# EAGLE design PiFlash (EAGLE 9.6.2)

## Sheet 1 of 4: PI Connection
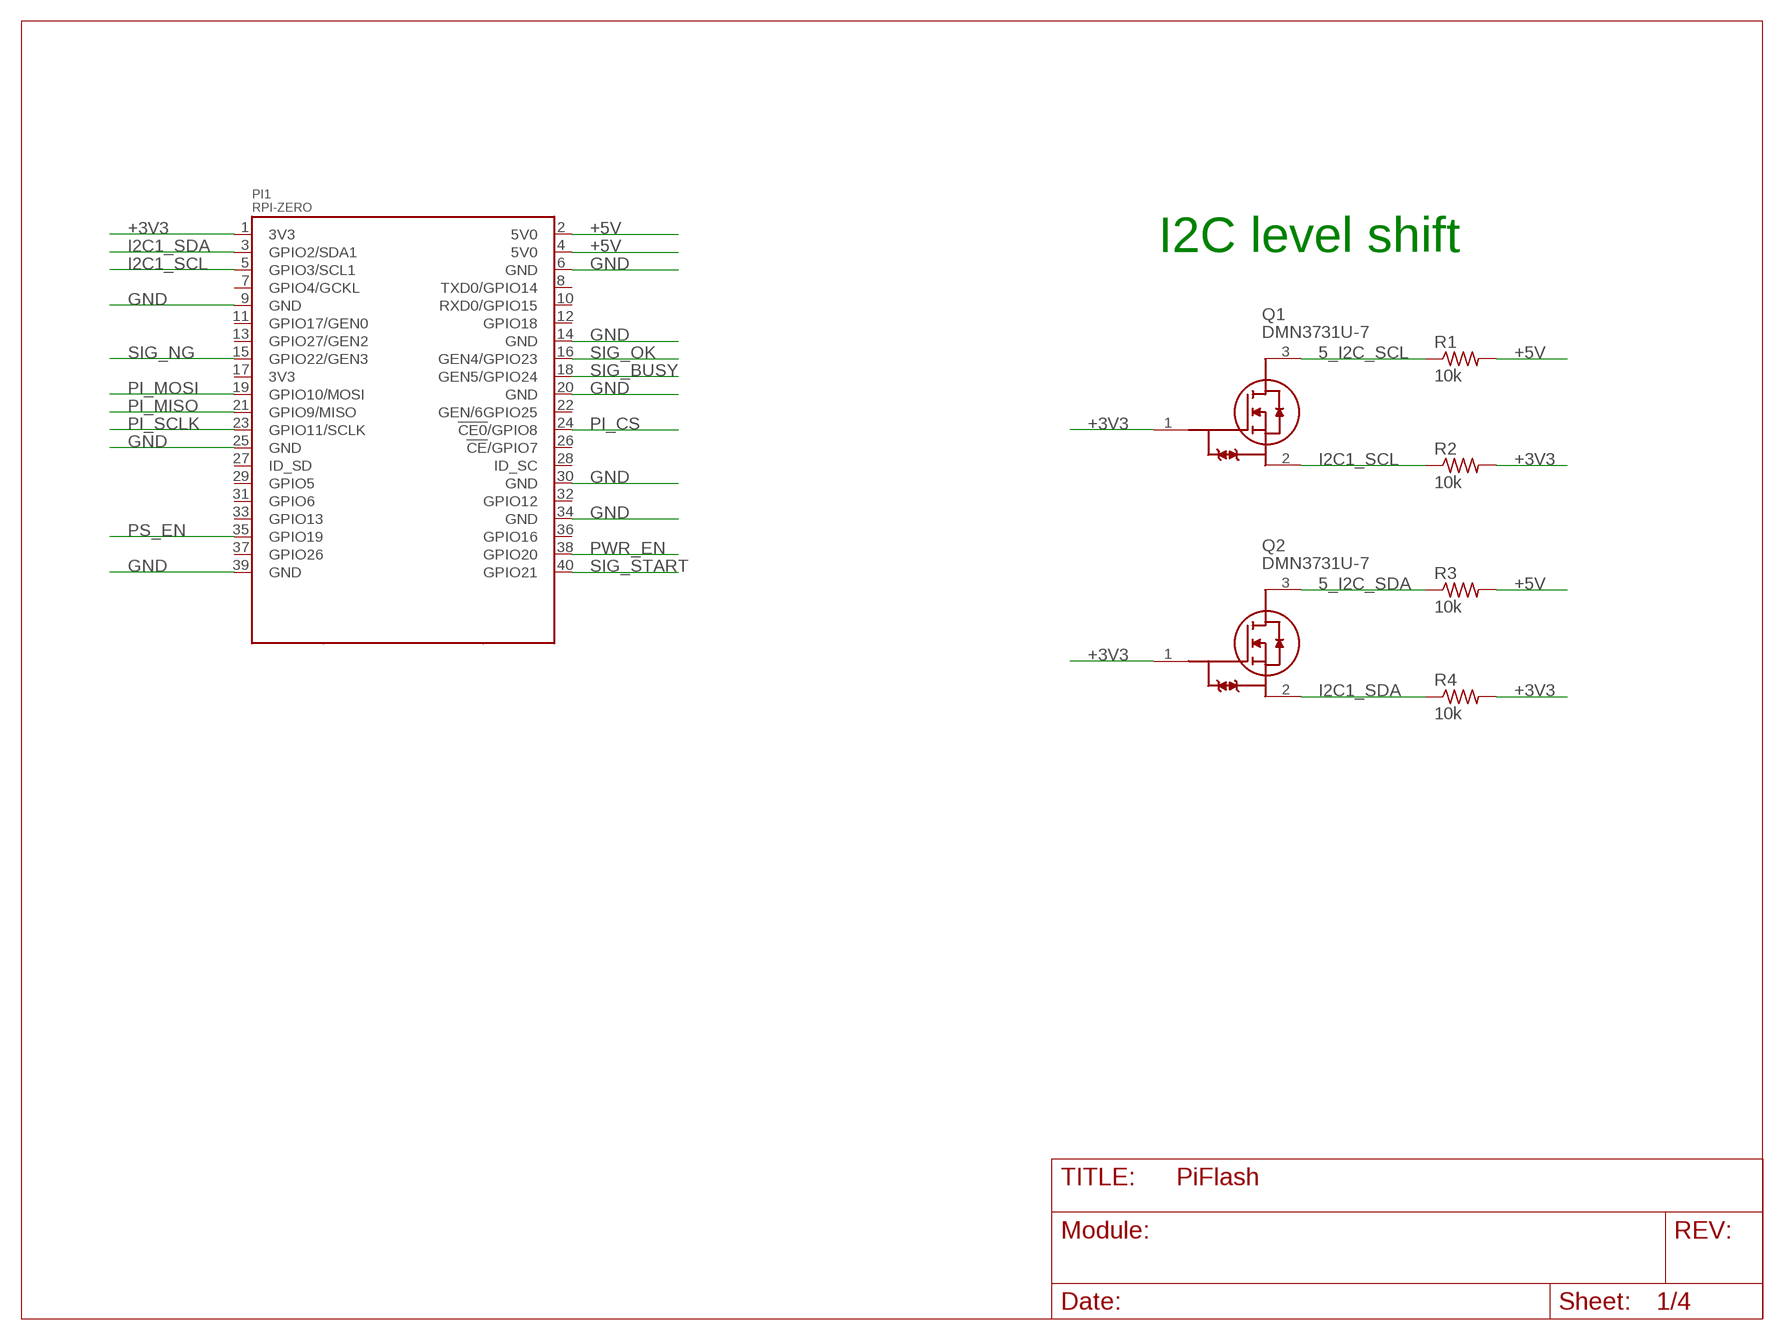
[diagram p0: schematic, sheet 1]

### Parts
PI1  RPI-ZERO  [RASPBERRYPI_BASTELSTUBE_V13_RASPI_BOARD_B+_FULL]
Q1  DMN3731U-7  [SOT96P240X110-3N]
Q2  DMN3731U-7  [SOT96P240X110-3N]
R1  10k  R-US_R0603  [R0603]
R2  10k  R-US_R0603  [R0603]
R3  10k  R-US_R0603  [R0603]
R4  10k  R-US_R0603  [R0603]

### Nets
5_I2C_SCL: Q1.3(D) R1.1 ; also sheet 2,3
5_I2C_SDA: Q2.3(D) R3.1 ; also sheet 2,3
+3V3: PI1.1(3V3) Q1.1(G) Q2.1(G) R2.2 R4.2 ; also sheet 2,3,4
+5V: PI1.2(5V0) PI1.4(5V0) R1.2 R3.2 ; also sheet 2,3
GND: PI1.6(GND) PI1.9(GND) PI1.14(GND) PI1.20(GND) PI1.25(GND) PI1.30(GND) PI1.34(GND) PI1.39(GND) ; also sheet 2,3,4
I2C1_SCL: PI1.5(GPIO3/SCL1) Q1.2(S) R2.1 ; also sheet 3
I2C1_SDA: PI1.3(GPIO2/SDA1) Q2.2(S) R4.1 ; also sheet 3
PI_CS: PI1.24(!CE0!/GPIO8) ; also sheet 4
PI_MISO: PI1.21(GPIO9/MISO) ; also sheet 4
PI_MOSI: PI1.19(GPIO10/MOSI) ; also sheet 4
PI_SCLK: PI1.23(GPIO11/SCLK) ; also sheet 4
PS_EN: PI1.35(GPIO19) ; also sheet 2
PWR_EN: PI1.38(GPIO20) ; also sheet 2
SIG_BUSY: PI1.18(GEN5/GPIO24) ; also sheet 4
SIG_NG: PI1.15(GPIO22/GEN3) ; also sheet 4
SIG_OK: PI1.16(GEN4/GPIO23) ; also sheet 4
SIG_START: PI1.40(GPIO21) ; also sheet 4
Unconnected: PI1.7(GPIO4/GCKL) PI1.8(TXD0/GPIO14) PI1.10(RXD0/GPIO15) PI1.11(GPIO17/GEN0) PI1.12(GPIO18) PI1.13(GPIO27/GEN2) PI1.17(3V3) PI1.22(GEN/6GPIO25) PI1.26(!CE!/GPIO7) PI1.27(ID_SD) PI1.28(ID_SC) PI1.29(GPIO5) PI1.31(GPIO6) PI1.32(GPIO12) PI1.33(GPIO13) PI1.36(GPIO16) PI1.37(GPIO26)

### Notes on the sheet
- I2C level shift

## Sheet 2 of 4: Power supply
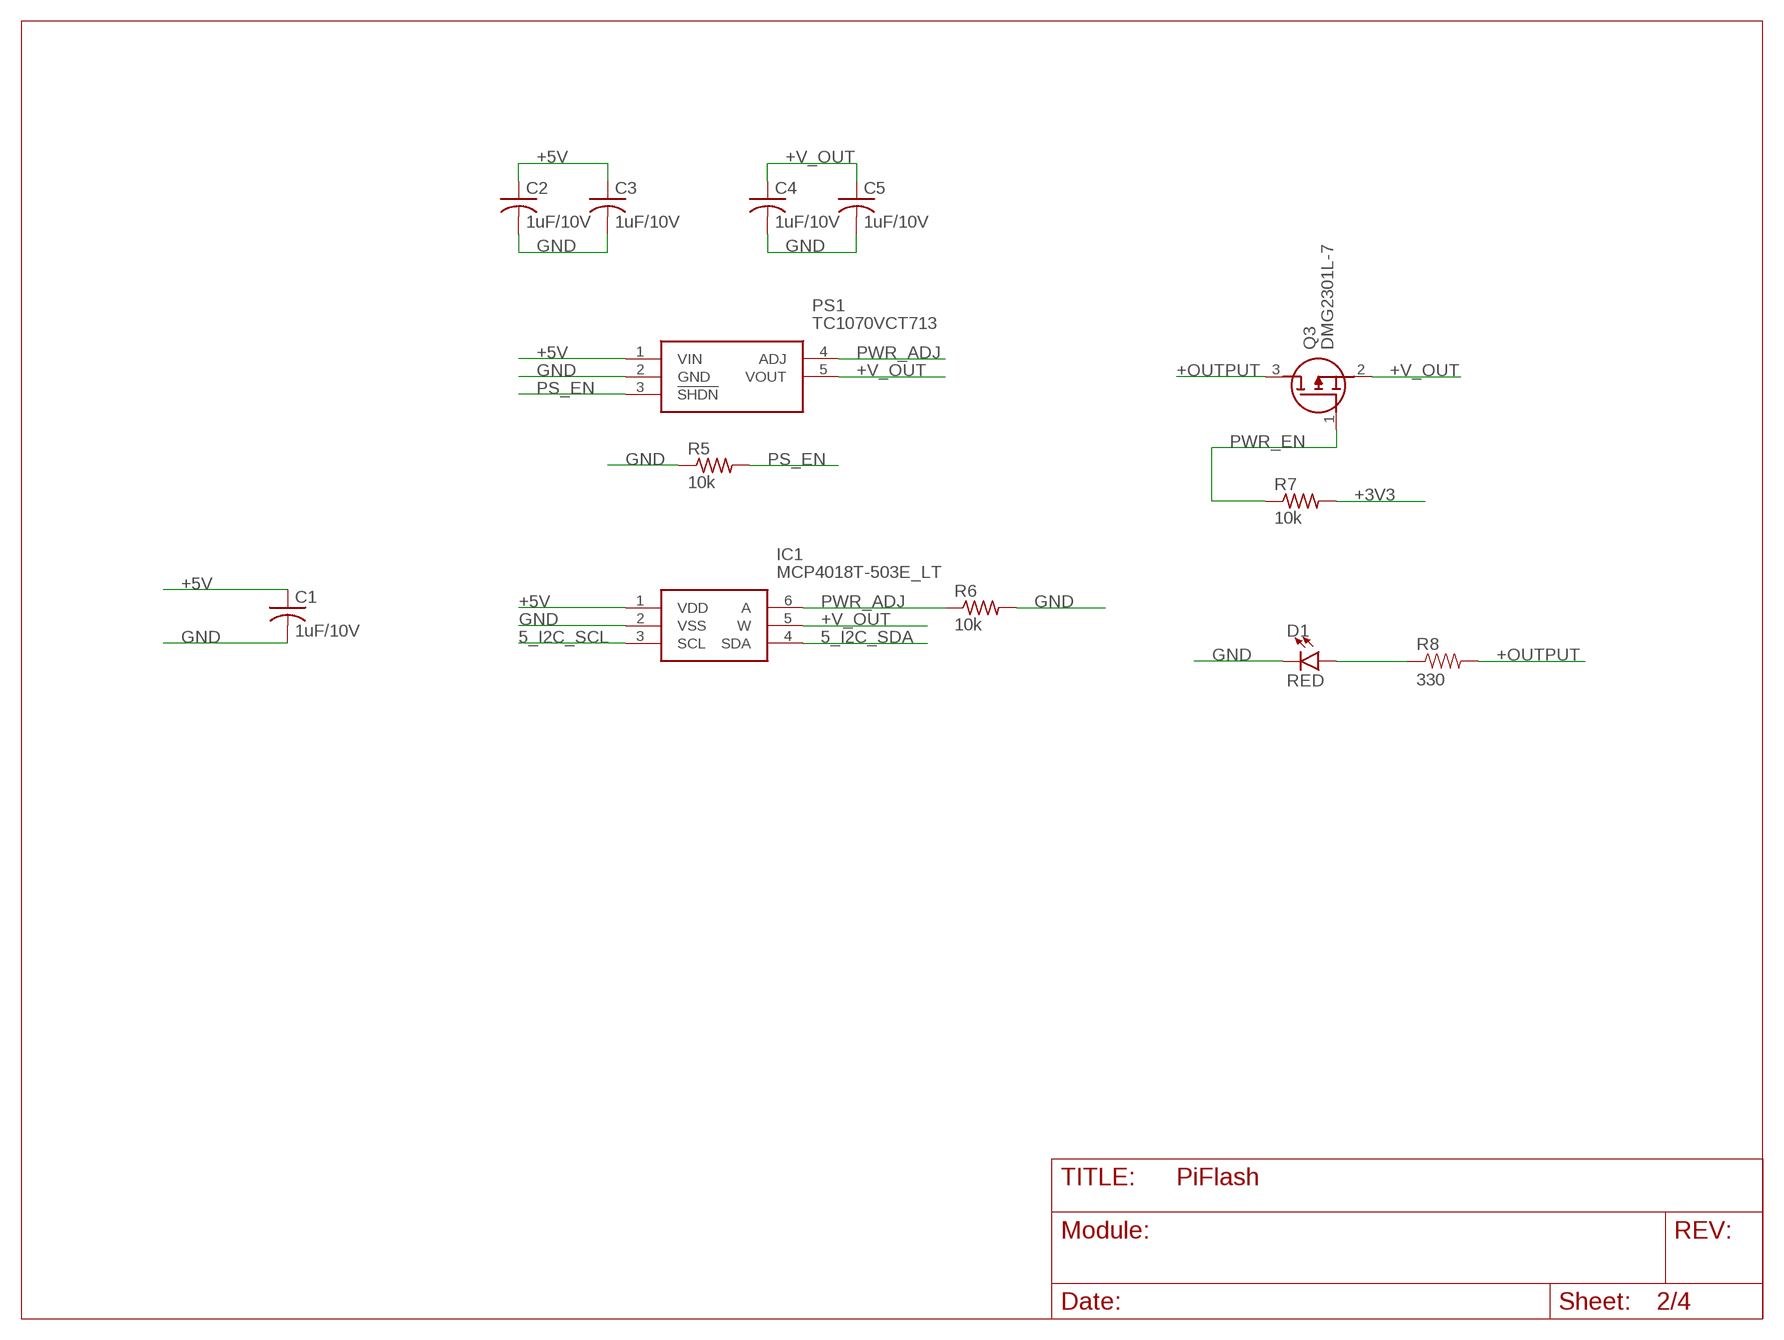
[diagram p1: schematic, sheet 2]

### Parts
C1  1uF/10V  C-USC0603  [C0603]
C2  1uF/10V  C-USC0603  [C0603]
C3  1uF/10V  C-USC0603  [C0603]
C4  1uF/10V  C-USC0603  [C0603]
C5  1uF/10V  C-USC0603  [C0603]
D1  RED  LED-RED_0402  [LED-0402]
IC1  MCP4018T-503E_LT  [SOT65P210X110-6N]
PS1  TC1070VCT713  [SOT95P280X145-5N]
Q3  DMG2301L-7  [SOT96P240X110-3N]
R5  10k  R-US_R0603  [R0603]
R6  10k  R-US_R0603  [R0603]
R7  10k  R-US_R0603  [R0603]
R8  330  RES_0402R0402  [0402]

### Nets
5_I2C_SCL: IC1.3(SCL) ; also sheet 1,3
5_I2C_SDA: IC1.4(SDA) ; also sheet 1,3
+3V3: R7.2 ; also sheet 1,3,4
+5V: C1.1 C2.1 C3.1 IC1.1(VDD) PS1.1(VIN) ; also sheet 1,3
+OUTPUT: Q3.3(D) R8.2 ; also sheet 3,4
+V_OUT: C4.1 C5.1 IC1.5(W) PS1.5(VOUT) Q3.2(S) ; also sheet 3,4
GND: C1.2 C2.2 C3.2 C4.2 C5.2 D1.C IC1.2(VSS) PS1.2(GND) R5.1 R6.2 ; also sheet 1,3,4
N$1: D1.A R8.1
PS_EN: PS1.3(!SHDN) R5.2 ; also sheet 1
PWR_ADJ: IC1.6(A) PS1.4(ADJ) R6.1
PWR_EN: Q3.1(G) R7.1 ; also sheet 1

## Sheet 3 of 4: Voltage monitor
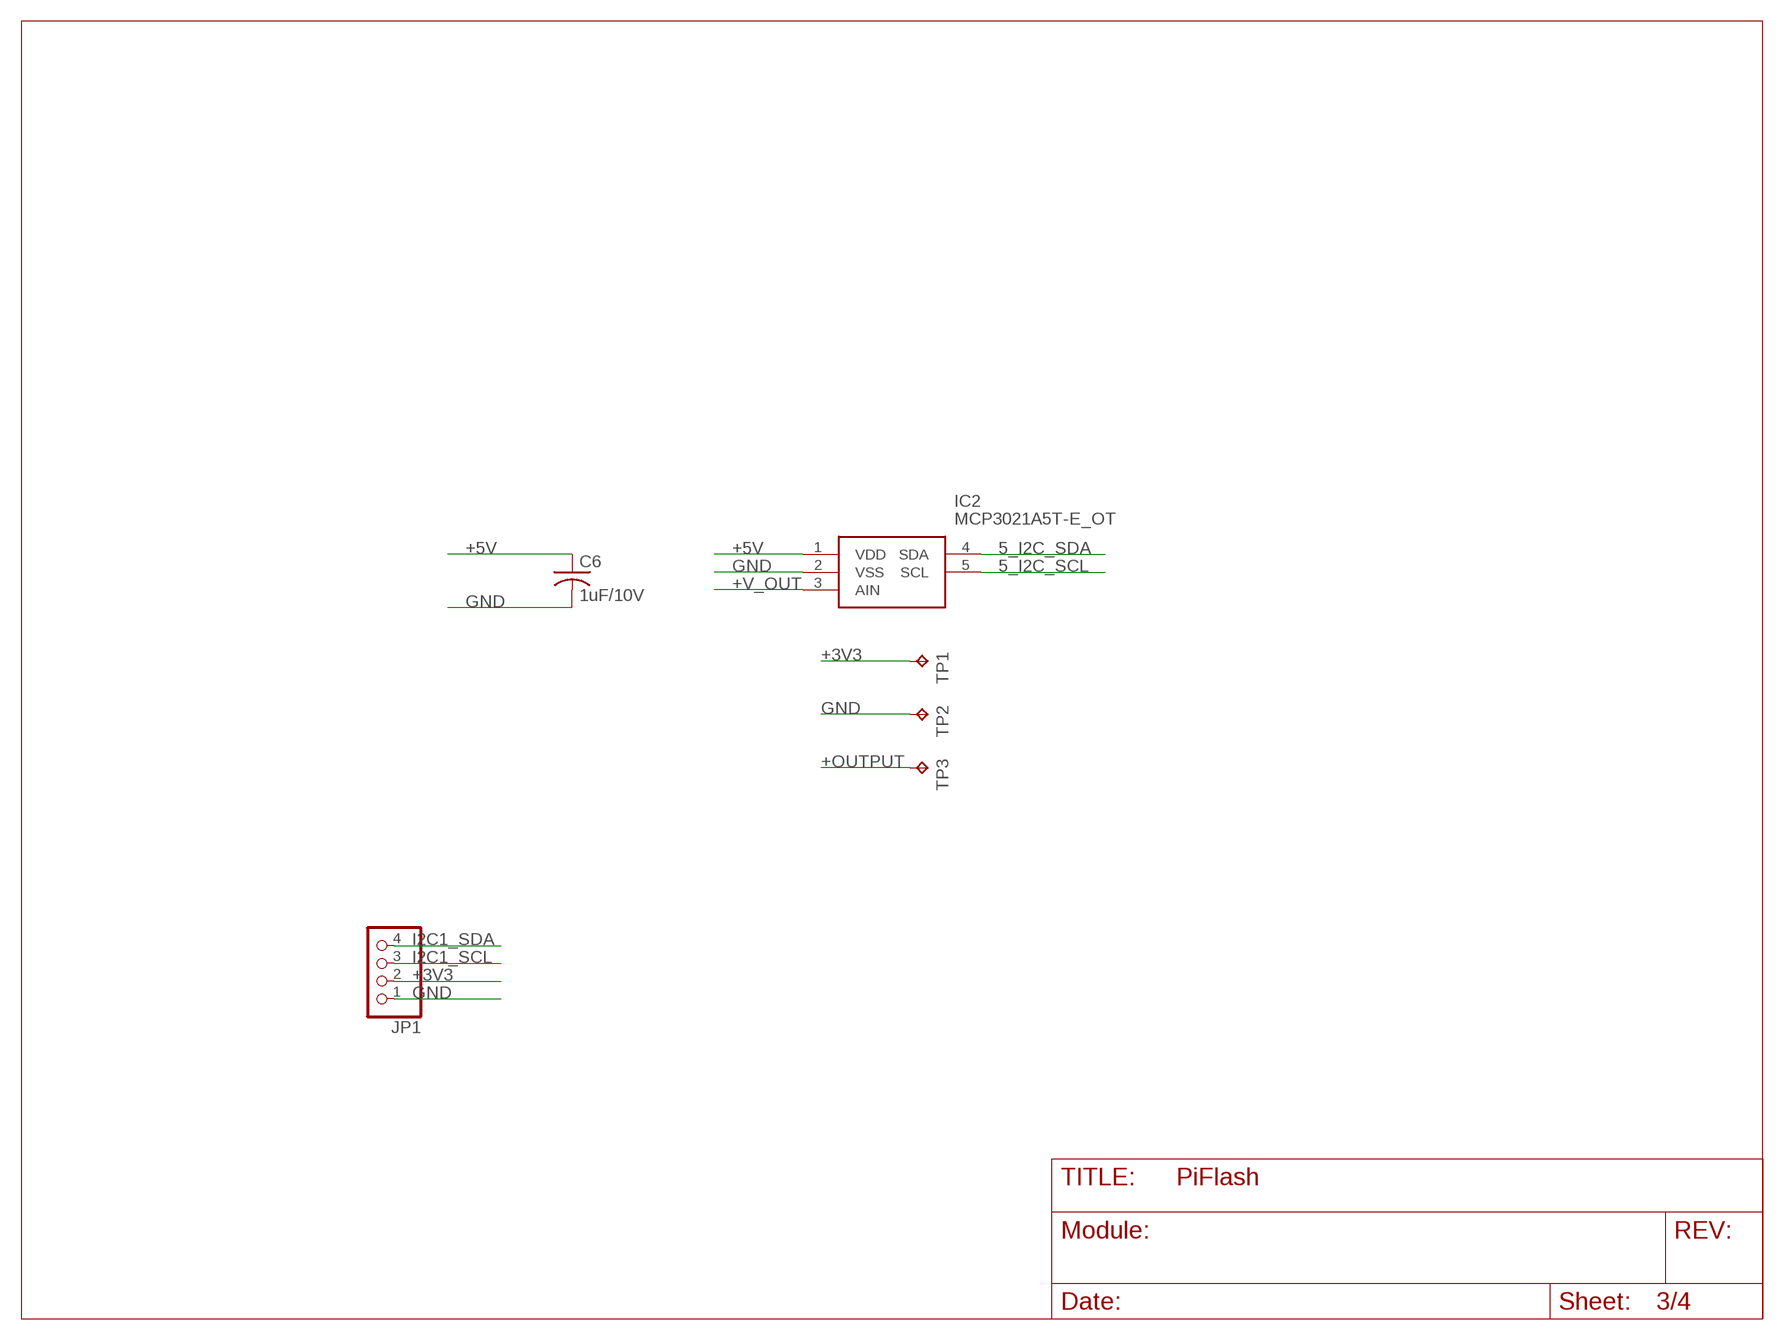
[diagram p2: schematic, sheet 3]

### Parts
C6  1uF/10V  C-USC0603  [C0603]
IC2  MCP3021A5T-E_OT  [SOT95P280X145-5N]
JP1  PINHD-1X41X04_RND  [1X04_SMALL]
TP1  +3v3  TPTP16R  [TP16R]
TP2  TPTP16R  [TP16R]
TP3  TPTP16R  [TP16R]

### Nets
5_I2C_SCL: IC2.5(SCL) ; also sheet 1,2
5_I2C_SDA: IC2.4(SDA) ; also sheet 1,2
+3V3: JP1.2 TP1.TP ; also sheet 1,2,4
+5V: C6.1 IC2.1(VDD) ; also sheet 1,2
+OUTPUT: TP3.TP ; also sheet 2,4
+V_OUT: IC2.3(AIN) ; also sheet 2,4
GND: C6.2 IC2.2(VSS) JP1.1 TP2.TP ; also sheet 1,2,4
I2C1_SCL: JP1.3 ; also sheet 1
I2C1_SDA: JP1.4 ; also sheet 1

## Sheet 4 of 4: Output
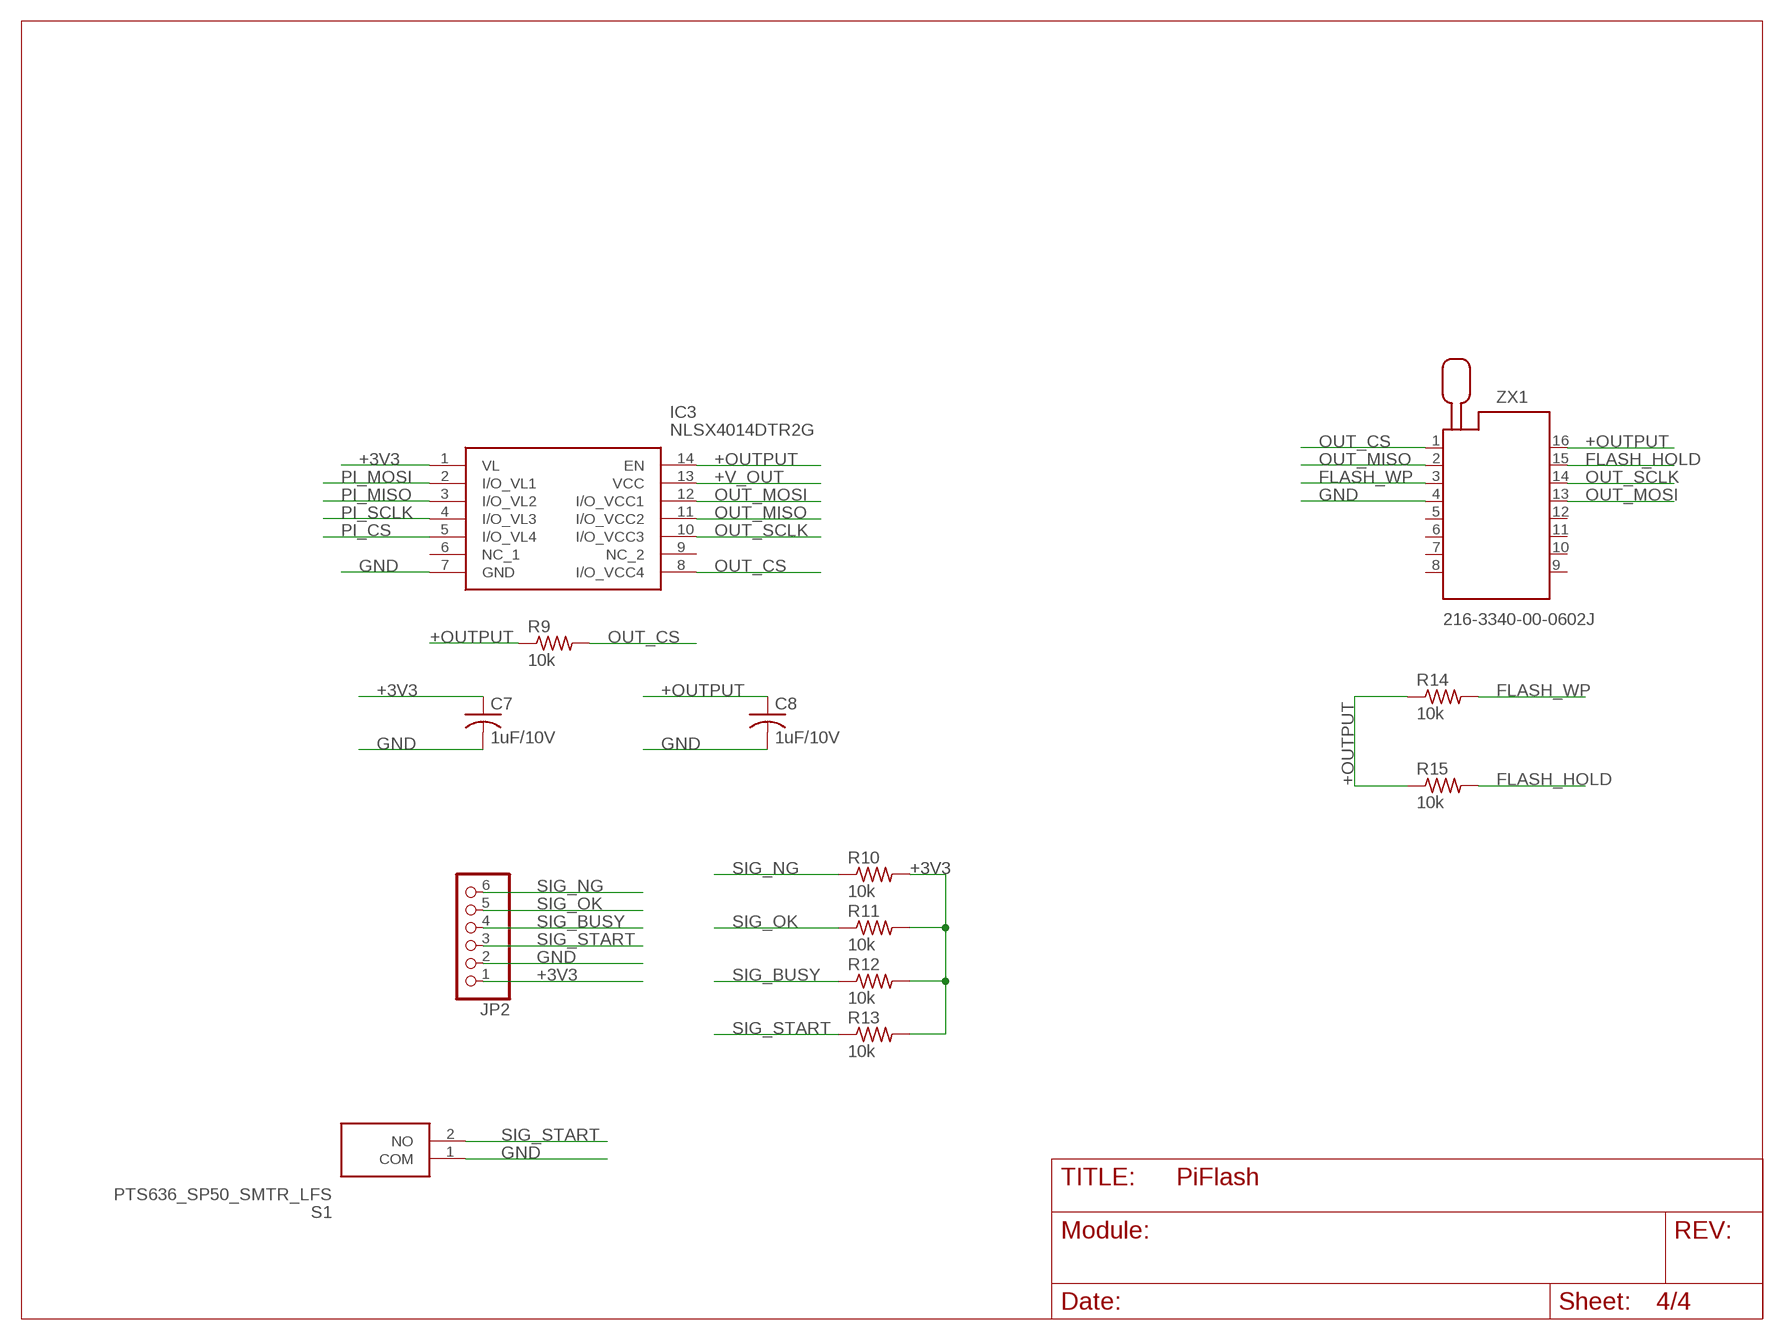
[diagram p3: schematic, sheet 4]

### Parts
C7  1uF/10V  C-USC0603  [C0603]
C8  1uF/10V  C-USC0603  [C0603]
IC3  NLSX4014DTR2G  [SOP65P640X120-14N]
JP2  PINHD-1X6  [1X06]
R9  10k  R-US_R0603  [R0603]
R10  10k  R-US_R0603  [R0603]
R11  10k  R-US_R0603  [R0603]
R12  10k  R-US_R0603  [R0603]
R13  10k  R-US_R0603  [R0603]
R14  10k  R-US_R0603  [R0603]
R15  10k  R-US_R0603  [R0603]
S1  PTS636_SP50_SMTR_LFS  [PTS636SP50SMTRLFS]
ZX1  216-3340-00-0602J  [216-3340-00-0602J]

### Nets
+3V3: C7.1 IC3.1(VL) JP2.1 R10.2 R11.2 R12.2 R13.2 ; also sheet 1,2,3
+OUTPUT: C8.1 IC3.14(EN) R9.1 R14.1 R15.1 ZX1.16 ; also sheet 2,3
+V_OUT: IC3.13(VCC) ; also sheet 2,3
FLASH_HOLD: R15.2 ZX1.15
FLASH_WP: R14.2 ZX1.3
GND: C7.2 C8.2 IC3.7(GND) JP2.2 S1.1(COM) ZX1.4 ; also sheet 1,2,3
OUT_CS: IC3.8(I/O_VCC4) R9.2 ZX1.1
OUT_MISO: IC3.11(I/O_VCC2) ZX1.2
OUT_MOSI: IC3.12(I/O_VCC1) ZX1.13
OUT_SCLK: IC3.10(I/O_VCC3) ZX1.14
PI_CS: IC3.5(I/O_VL4) ; also sheet 1
PI_MISO: IC3.3(I/O_VL2) ; also sheet 1
PI_MOSI: IC3.2(I/O_VL1) ; also sheet 1
PI_SCLK: IC3.4(I/O_VL3) ; also sheet 1
SIG_BUSY: JP2.4 R12.1 ; also sheet 1
SIG_NG: JP2.6 R10.1 ; also sheet 1
SIG_OK: JP2.5 R11.1 ; also sheet 1
SIG_START: JP2.3 R13.1 S1.2(NO) ; also sheet 1
Unconnected: IC3.6(NC_1) IC3.9(NC_2) ZX1.5 ZX1.6 ZX1.7 ZX1.8 ZX1.9 ZX1.10 ZX1.11 ZX1.12

## Library data of the parts
C1-C8 = SeanLib:C-US: CAPACITOR, American symbol; SPICEPREFIX: C
D1 = SparkFun-LED:LED-RED: Red SMD LED Used in manufacturing of most products at SparkFun Packages: 0603 - KB - KingBright (DIO-17976) SMD 0603 package [Datasheet] <https://www.kingbrightusa.com/images/catalog/SPEC/APT1608SURCK.pdf> 0603 - (DIO-00819, has gone EOL) SMD 0603 package 0603 SMART - SMD 0603 SMART package ( more efficient and expensive)[Product Link] <http://www.osram-os.com/Graphics/XPic2/00077099_0.pdf> 1206 - SMD1206 package [Product Link] <https://www.sparkfun.com/datasheets/DevTools/LilyPad/Q150OVS4.pdff> SparkFun Products: Pro Mini 328 -5V <https://www.sparkfun.com/products/821> RedBoard <https://www.sparkfun.com/products/12757> IOIO-OTG <https://www.sparkfun.com/products/13613>; PROD_ID: DIO-16757
IC1 = SamacSys_Parts:MCP4018T-503E_LT: Digital POT Source: Datasheet <http://componentsearchengine.com/Datasheets/1/MCP4018T-503E_LT.pdf>; ARROW_PART_NUMBER: MCP4018T-503E/LT; ARROW_PRICE-STOCK: https://www.arrow.com/en/products/mcp4018t-503elt/microchip-technology?region=nac; DESCRIPTION: Digital POT; HEIGHT: 1.1mm; MANUFACTURER_NAME: Microchip; MANUFACTURER_PART_NUMBER: MCP4018T-503E/LT; MOUSER_PART_NUMBER: 579-MCP4018T503E/LT; MOUSER_PRICE-STOCK: https://www.mouser.co.uk/ProductDetail/Microchip-Technology/MCP4018T-503E-LT?qs=%2FsslhGPpiOSzdsHYTCrgKw%3D%3D
IC2 = SamacSys_Parts:MCP3021A5T-E_OT: Analog to Digital Converters - ADC 10-bit I2C Sgl Chnl Source: Datasheet <https://lcsc.componentsearchengine.com/Datasheets/2/MCP3021A5T-E_OT.pdf>; ARROW_PART_NUMBER: MCP3021A5T-E/OT; ARROW_PRICE-STOCK: https://www.arrow.com/en/products/mcp3021a5t-eot/microchip-technology?region=nac; DESCRIPTION: Analog to Digital Converters - ADC 10-bit I2C Sgl Chnl; HEIGHT: 1.45mm; MANUFACTURER_NAME: Microchip; MANUFACTURER_PART_NUMBER: MCP3021A5T-E/OT; MOUSER_PART_NUMBER: 579-MCP3021A5T-E/OT; MOUSER_PRICE-STOCK: https://www.mouser.co.uk/ProductDetail/Microchip-Technology/MCP3021A5T-E-OT?qs=gySgac5WNsGj4n43R%252BIXjw%3D%3D
IC3 = SamacSys_Parts:NLSX4014DTR2G: Voltage Level Shifter 4-CH Bidirectional 14-Pin TSSOP W T/R Source: Datasheet <https://www.arrow.com/en/products/nlsx4014dtr2g/on-semiconductor?region=nac>; ARROW_PART_NUMBER: NLSX4014DTR2G; ARROW_PRICE-STOCK: https://www.arrow.com/en/products/nlsx4014dtr2g/on-semiconductor?region=nac; DESCRIPTION: Voltage Level Shifter 4-CH Bidirectional 14-Pin TSSOP W T/R; HEIGHT: 1.2mm; MANUFACTURER_NAME: onsemi; MANUFACTURER_PART_NUMBER: NLSX4014DTR2G; MOUSER_PART_NUMBER: 863-NLSX4014DTR2G; MOUSER_PRICE-STOCK: https://www.mouser.co.uk/ProductDetail/onsemi/NLSX4014DTR2G?qs=zXUFZjqEZiiRmYN3I3OD7g%3D%3D
JP1 = SeanLib:PINHD-1X4: PIN HEADER
JP2 = pinhead:PINHD-1X6: PIN HEADER
PI1 = rpi-zero:RPI-ZERO
PS1 = SamacSys_Parts:TC1070VCT713: Microchip TC1070VCT713, LDO Voltage Regulator, Adjustable 50mA, 1.165 1.235 V, 5-Pin SOT-23 Source: Datasheet <https://componentsearchengine.com/Datasheets/1/TC1070VCT713.pdf>; ARROW_PART_NUMBER: TC1070VCT713; ARROW_PRICE-STOCK: https://www.arrow.com/en/products/tc1070vct713/microchip-technology?region=nac; DESCRIPTION: Microchip TC1070VCT713, LDO Voltage Regulator, Adjustable 50mA, 1.165 1.235 V, 5-Pin SOT-23; HEIGHT: 1.45mm; MANUFACTURER_NAME: Microchip; MANUFACTURER_PART_NUMBER: TC1070VCT713; MOUSER_PART_NUMBER: 579-TC1070VCT713; MOUSER_PRICE-STOCK: https://www.mouser.co.uk/ProductDetail/Microchip-Technology/TC1070VCT713?qs=9y3LFqDLL8JBE%2FZTKxNk6A%3D%3D
Q1 Q2 = SamacSys_Parts:DMN3731U-7: MOSFET MOSFET BVDSS: 25V-30V Source: Datasheet <https://www.mouser.fr/datasheet/2/115/DMN3731U-1594715.pdf>; DESCRIPTION: MOSFET MOSFET BVDSS: 25V-30V; HEIGHT: 1.1mm; MANUFACTURER_NAME: Diodes Inc.; MANUFACTURER_PART_NUMBER: DMN3731U-7; MOUSER_PART_NUMBER: 621-DMN3731U-7; MOUSER_PRICE-STOCK: https://www.mouser.co.uk/ProductDetail/Diodes-Incorporated/DMN3731U-7?qs=EBDBlbfErPyEqvOCBrONHQ%3D%3D
Q3 = SamacSys_Parts:DMG2301L-7: MOSFET MOSFET BVDSS Source: Datasheet <https://www.mouser.com/datasheet/2/115/DMG2301L-959562.pdf>; ARROW_PART_NUMBER: DMG2301L-7; ARROW_PRICE-STOCK: https://www.arrow.com/en/products/dmg2301l-7/diodes-incorporated?region=nac; DESCRIPTION: MOSFET MOSFET BVDSS; HEIGHT: 1.1mm; MANUFACTURER_NAME: Diodes Inc.; MANUFACTURER_PART_NUMBER: DMG2301L-7; MOUSER_PART_NUMBER: 621-DMG2301L-7; MOUSER_PRICE-STOCK: https://www.mouser.co.uk/ProductDetail/Diodes-Incorporated/DMG2301L-7?qs=60RJRzIpcl8mqpUzCaZuxQ%3D%3D
R1-R7 R9-R15 = SeanLib:R-US_: RESISTOR, American symbol; SPICEPREFIX: R
R8 = Perfect_0402:RES_0402: 0402 (1005 Metric) Nick Garner - TeleSense
S1 = SamacSys_Parts:PTS636_SP50_SMTR_LFS: Tactile Switches Tact 50mA 12VDC, 6.0x3.5, 5.0mm H, 320gf, G leads, No ground pin, Black Actuator Source: Datasheet <https://componentsearchengine.com/Datasheets/1/PTS636SP50SMTRLFS.pdf>; ARROW_PART_NUMBER: PTS636 SP50 SMTR LFS; ARROW_PRICE-STOCK: https://www.arrow.com/en/products/pts636-sp50-smtr-lfs/ck; DESCRIPTION: Tactile Switches Tact 50mA 12VDC, 6.0x3.5, 5.0mm H, 320gf, G leads, No ground pin, Black Actuator; HEIGHT: 5.2mm; MANUFACTURER_NAME: C & K COMPONENTS; MANUFACTURER_PART_NUMBER: PTS636 SP50 SMTR LFS; MOUSER_PART_NUMBER: 611-PTS636SP50SMTRLF; MOUSER_PRICE-STOCK: https://www.mouser.co.uk/ProductDetail/CK/PTS636-SP50-SMTR-LFS?qs=vLWxofP3U2yQrwr1QnrRJw%3D%3D
TP1-TP3 = testpad:TP: Test pad
ZX1 = con-3m:216-3340-00-0602J: Zero Insertion Force Socked Source: http://www.3M.com/ehpd; MF: 3M; MPN: 216-3340-00-0602J; OC_FARNELL: 1674399; OC_NEWARK: 85K7797

## Board
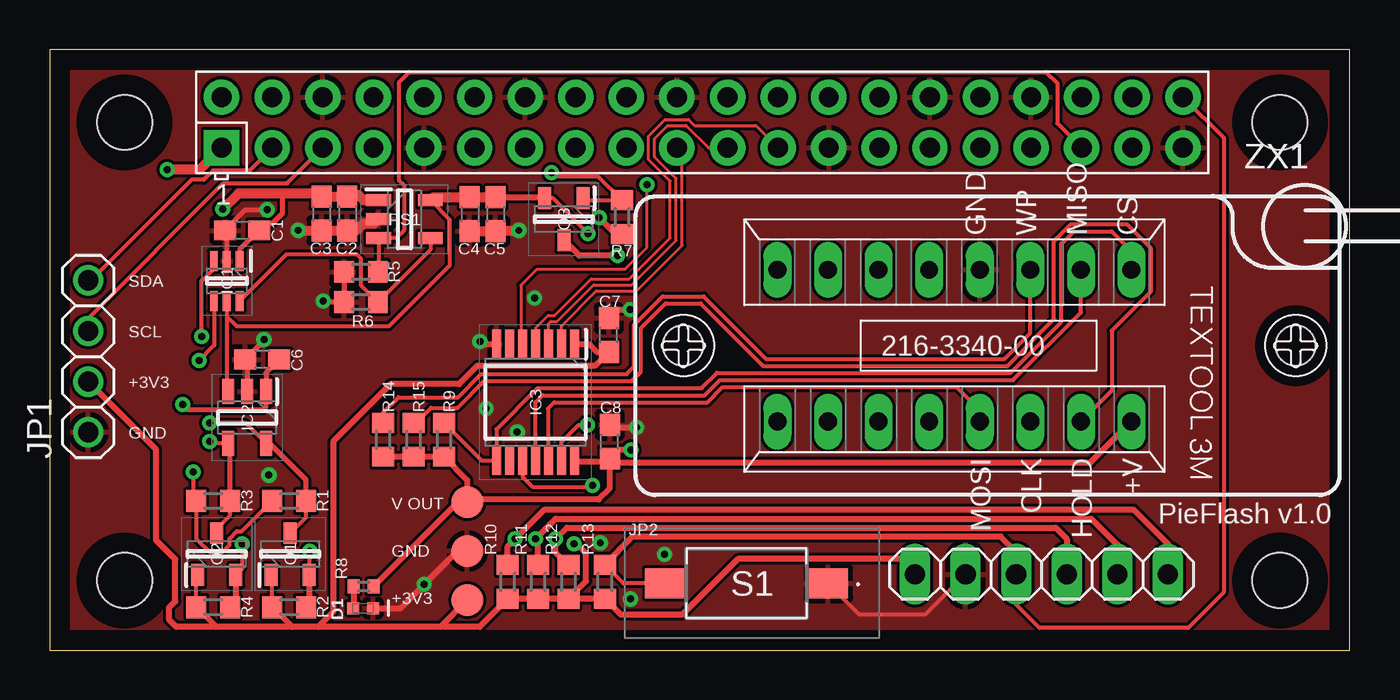
[diagram p4: board, top side]
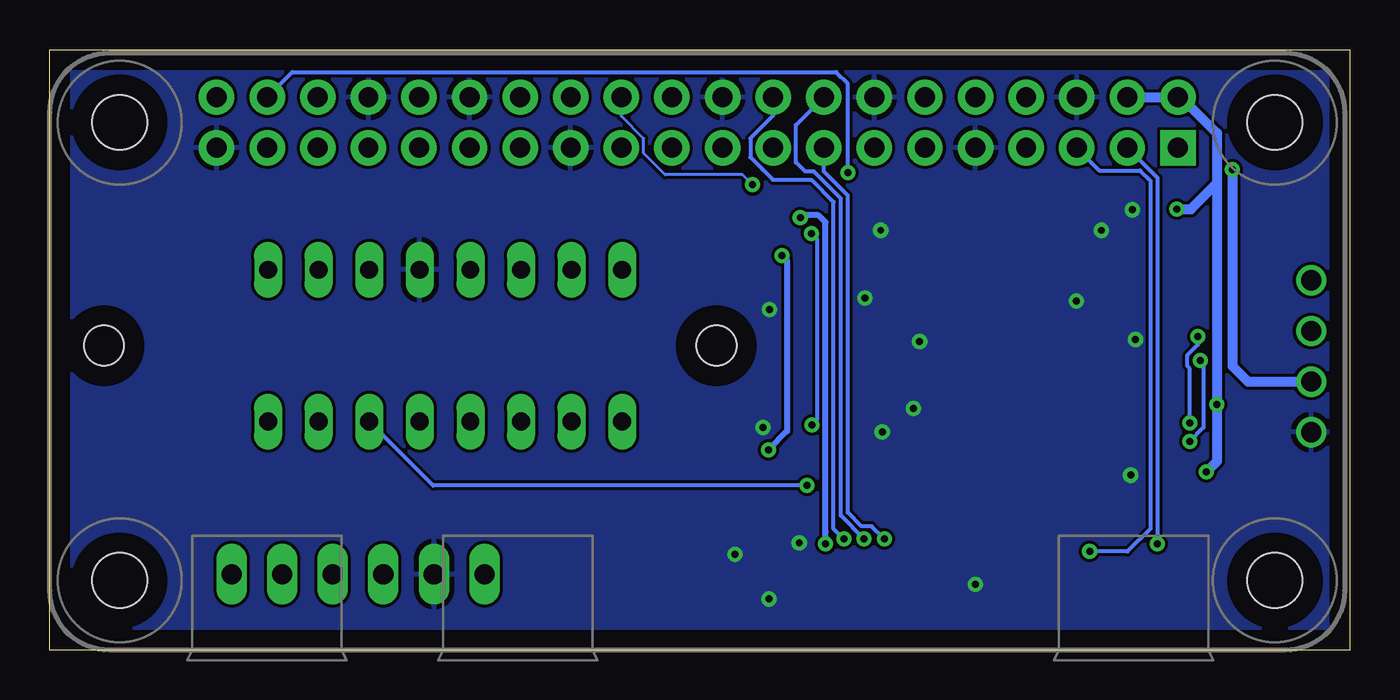
[diagram p5: board, bottom side, seen from below]

Size 65.26 x 30.15 mm. Coordinates in mm from the lower left corner, seen from the top.
Outline: 0,0 65.26,0 65.26,30.15 0,30.15 0,0
Copper layers (1*16): Top 0.035mm / dielectric 1.5mm / Bottom 0.035mm
Design rules "default *": minimum track width 6mil, minimum drill 0.35mm, track to track 6mil, track to pad 6mil, pad to pad 6mil, via to via 6mil, smd to smd 6mil, copper to edge 40mil, drill to drill 6mil, minimum pad ring 10mil, minimum via ring 8mil, stop-mask expansion 4mil, vias tented up to drill 20mil, thermal gap 10mil

### Footprints (pad centres in the part's own frame; a part is rotated, then mirrored left to right if it is on the bottom)
C0603 = smd 1.1 x 1: 1 -0.85,0; 2 0.85,0
LED-0402 = smd 0.6 x 0.6: A -0.5,0; C 0.5,0
SOT65P210X110-6N = smd 1 x 0.4: 1 -1,0.65; 2 -1,0; 3 -1,-0.65; 4 1,-0.65; 5 1,0; 6 1,0.65
SOT95P280X145-5N = smd 1.25 x 0.6: 1 -1.3,0.95; 2 -1.3,0; 3 -1.3,-0.95; 4 1.3,-0.95; 5 1.3,0.95
SOP65P640X120-14N = smd 1.45 x 0.45: 1 -2.925,1.95; 2 -2.925,1.3; 3 -2.925,0.65; 4 -2.925,0; 5 -2.925,-0.65; 6 -2.925,-1.3; 7 -2.925,-1.95; 8 2.925,-1.95; 9 2.925,-1.3; 10 2.925,-0.65; 11 2.925,0; 12 2.925,0.65; 13 2.925,1.3; 14 2.925,1.95
1X04_SMALL = drill 1.016: 1 -3.81,0; 2 -1.27,0; 3 1.27,0; 4 3.81,0
1X06 = drill 1.016 long: 1 -6.35,0; 2 -3.81,0; 3 -1.27,0; 4 1.27,0; 5 3.81,0; 6 6.35,0
RASPBERRYPI_BASTELSTUBE_V13_RASPI_BOARD_B+_FULL = drill 1 pad 1.778 square: 1 8.37,25.23 | drill 1 pad 1.778: 2 8.37,27.77; 3 10.91,25.23; 4 10.91,27.77; 5 13.45,25.23; 6 13.45,27.77; 7 15.99,25.23; 8 15.99,27.77; 9 18.53,25.23; 10 18.53,27.77; 11 21.07,25.23; 12 21.07,27.77; 13 23.61,25.23; 14 23.61,27.77; 15 26.15,25.23; 16 26.15,27.77; 17 28.69,25.23; 18 28.69,27.77; 19 31.23,25.23; 20 31.23,27.77; 21 33.77,25.23; 22 33.77,27.77; 23 36.31,25.23; 24 36.31,27.77; 25 38.85,25.23; 26 38.85,27.77; 27 41.39,25.23; 28 41.39,27.77; 29 43.93,25.23; 30 43.93,27.77; 31 46.47,25.23; 32 46.47,27.77; 33 49.01,25.23; 34 49.01,27.77; 35 51.55,25.23; 36 51.55,27.77; 37 54.09,25.23; 38 54.09,27.77; 39 56.63,25.23; 40 56.63,27.77 | hole 2.75: 3.5,3.5; 3.5,26.5; 61.5,3.5; 61.5,26.5
SOT96P240X110-3N = smd 1.1 x 0.65: 1 -1.05,0.96; 2 -1.05,-0.96; 3 1.05,0
R0603 = smd 1 x 1.1: 1 -0.85,0; 2 0.85,0
0402 = smd 0.6 x 0.7: 1 -0.5,0; 2 0.5,0
PTS636SP50SMTRLFS = smd 2 x 1.5: 1 -4.1,0; 2 4.1,0
TP16R = smd 1.6 x 1.6: TP 0,0
216-3340-00-0602J = drill 0.9 long: 1 -8.89,-3.81; 2 -6.35,-3.81; 3 -3.81,-3.81; 4 -1.27,-3.81; 5 1.27,-3.81; 6 3.81,-3.81; 7 6.35,-3.81; 8 8.89,-3.81; 9 8.89,3.81; 10 6.35,3.81; 11 3.81,3.81; 12 1.27,3.81; 13 -1.27,3.81; 14 -3.81,3.81; 15 -6.35,3.81; 16 -8.89,3.81 | hole 2: 13.62,0; -17.12,0

### Placement (x,y rotation side)
C1  9.65,21.08 180 top
C2  14.94,21.92 270 top
C3  13.64,21.92 270 top
C4  21.08,21.89 270 top
C5  22.38,21.89 270 top
C6  10.67,14.61 180 top
C7  28.07,15.82 90 top
C8  28.12,10.46 90 top
D1  15.72,2.11 0 top
IC1  8.89,18.54 270 top
IC2  9.91,11.68 270 top
IC3  24.38,12.45 270 top
JP1  1.93,14.76 90 top
JP2  49.78,3.81 0 top
PI1  0.25,0 0 top
PS1  17.81,21.64 0 top
Q1  12.06,4.83 90 top
Q2  8.38,4.83 90 top
Q3  25.81,21.64 270 top
R1  12.01,7.49 180 top
R2  12.01,2.16 180 top
R3  8.2,7.49 180 top
R4  8.2,2.16 180 top
R5  15.62,19 0 top
R6  15.62,17.48 180 top
R7  28.73,21.74 270 top
R8  15.75,3.2 0 top
R9  19.79,10.57 90 top
R10  22.99,3.43 270 top
R11  24.51,3.43 270 top
R12  26.04,3.43 270 top
R13  27.86,3.43 270 top
R14  16.74,10.57 90 top
R15  18.26,10.57 90 top
S1  34.98,3.35 180 top
TP1  20.95,2.51 0 top
TP2  20.95,4.98 0 top
TP3  20.95,7.44 0 top
ZX1  45.42,15.29 180 top

### Tracks (layer width: path | path; a pad name or v marks a point on that pad's centre or on a via)
5_I2C_SCL  (via drill 0.35)
  Top 0.203: Q1.3 12.86,6.67 R1.1 | IC2.5 9.83,11.41 v8.03,11.41 | v7.62,15.75 7.62,18.54 8.24,19.16 IC1.3
  Top 0.254: IC2.5 11.04,10.38 12.86,8.56 R1.1
  Bottom 0.203: v8.03,11.41 8.03,14.14 8.15,14.27 8.15,14.81 7.62,15.34 v7.62,15.75
5_I2C_SDA  (via drill 0.35)
  Top 0.203: Q2.3 8.38,6.1 9.05,6.77 R3.1 | IC2.4 8.13,10.38 v8.03,10.49 | v7.49,14.55 8.26,15.32 8.26,17.53 IC1.4
  Top 0.254: R3.1 9.05,10.29 IC2.4
  Bottom 0.203: v7.49,14.55 7.34,14.4 7.34,11.18 v8.03,10.49
+3V3  (via drill 0.35)
  Top 0.203: R2.2 11.16,3.72 Q1.1 | R4.2 7.35,3.71 Q2.1
  Top 0.305: R12.2 R13.2 28.66,1.78 31.75,1.78 34.54,4.57 42.67,4.57 JP2.1 | R12.2 R11.2 R10.2 21.58,1.17 19.61,1.17 | 19.61,1.17 13.46,1.17 | 13.46,1.17 12.15,1.17 | 12.15,1.17 8.35,1.17 | 8.35,1.17 6.35,1.17 5.99,1.53 5.99,2.14 6.3,2.45 6.3,4.55 5.33,5.52 5.33,10.08 JP1.2 | R4.2 8.35,1.17 | R2.2 12.15,1.17 | TP1.TP 19.61,1.17 | 13.46,1.17 14.22,1.93 14.22,10.48 17.1,13.36 20.55,13.36 21.46,14.28 27.37,14.28 C7.1 27.46,14.97 27.06,15.37 IC3.1 | R12.2 26.92,3.47 26.92,4.87 26.46,5.33 v26.31,5.33 | v27.58,21.72 28.41,20.89 R7.2
  Top 0.508: PI1.1 7.52,24.13 v5.88,24.13
  Bottom 0.305: v26.31,5.33 26.31,5.92 26.31,5.93 26.31,21.49 26.67,21.84 27.46,21.84 v27.58,21.72
  Bottom 0.508: v5.88,24.13 5.88,14.27 5.11,13.49 JP1.2
+5V  (via drill 0.35)
  Top 0.203: v7.2,8.95 7.2,7.64 R3.2 7.35,5.6 8.13,4.83 8.57,4.83 9.02,5.28 9.02,5.6 9.39,5.97 9.64,5.97 R1.2
  Top 0.254: C6.1 10.86,13.94 IC2.1 10.84,12.97 10.84,12.22 10.69,12.06 6.95,12.06 v6.67,12.34 | IC1.1 9.54,20.12 C1.1 10.88,21.45 11.19,21.45 11.68,21.95 11.68,22.94
  Top 0.508: v8.69,22.15 9.47,22.94 11.68,22.94 13.47,22.94 C3.1 C2.1 15.03,22.86 15.49,22.86 15.76,22.59 PS1.1
  Bottom 0.508: PI1.4 PI1.2 8.47,27.77 6.67,25.97 6.67,23.45 | v7.2,8.95 6.67,9.48 v6.67,12.34 6.67,23.45 | v8.69,22.15 7.98,22.15 6.67,23.45
+OUTPUT  (via drill 0.35)
  Top 0.305: R14.1 R15.1 R9.1 20.95,8.55 TP3.TP | TP3.TP 21.08,7.57 27.56,7.57 28.12,8.13 C8.1 | IC3.14 26.4,9.45 27.96,9.45 C8.1 | R8.2 20.49,7.44 TP3.TP | ZX1.16 52.22,9.4 28.34,9.4 C8.1 | C8.1 28.56,10.06 v29.18,10.06 | v28.5,19.81 26.59,19.81 Q3.3
  Bottom 0.305: v28.5,19.81 28.25,19.56 28.25,11 v29.18,10.06
+V_OUT  (via drill 0.35)
  Top 0.203: PS1.5 20.07,21.63 20.07,19.3 17.02,16.26 9.4,16.26 8.89,16.76 | IC1.5 8.89,16.76 | 8.89,16.76 8.89,13.05 | IC3.13 25.68,10.44 26.54,11.3 v27,11.3 | v27.02,20.93 25.26,22.69 Q3.2
  Top 0.254: IC2.3 8.89,13.05
  Top 0.305: C5.1 24.79,22.75 Q3.2
  Top 0.508: PS1.5 19.26,22.75 C4.1 C5.1
  Bottom 0.203: v27,11.3 26.75,11.55 26.75,20.66 v27.02,20.93
FLASH_HOLD
  Top 0.203: R15.2 18.38,11.42 19.13,12.17 20.46,12.17 21.8,13.51 29.21,13.51 29.68,13.98 29.68,16.17 30.92,17.41 32.67,17.41 35.81,14.28 48.07,14.28 50.42,16.63 50.42,20.54 51.26,21.39 54.08,21.39 55.26,20.2 55.26,18 53.31,16.05 53.31,13.03 ZX1.15
FLASH_WP
  Top 0.203: R14.2 16.74,11.94 17.5,12.7 20.49,12.7 21.66,13.87 28.96,13.87 29.32,14.23 29.32,16.32 30.77,17.76 32.82,17.76 35.95,14.63 47.92,14.63 49.23,15.94 ZX1.3
GND  (via drill 0.35)
  Top 0.203: JP2.2 43.94,1.78 40.65,1.78 S1.1
  Top 0.254: R5.1 R6.2 13.77,17.48 v13.72,17.53 | IC2.2 9.91,14.52 C6.2 10.75,15.54 v10.75,15.6 | IC1.2 8.88,19.55 8.88,21.01 C1.2 9.83,22.11 v10.92,22.11
  Top 0.305: D1.C 17.6,2.11 v18.8,3.3 20.47,4.98 TP2.TP | v21.59,15.49 21.71,15.37 IC3.7 | C7.2 28.5,17.11 v29.12,17.11 | C8.2 28.26,11.18 v29.46,11.18
  Top 0.508: v12.47,21.08 13.63,21.08 C3.2 C2.2 15.38,21.07 15.71,21.4 16.26,21.4 PS1.2 | C4.2 C5.2 22.41,21.08 v23.55,21.08
  other vias: 21.89,12.14 29.16,2.57 24.33,17.68 30.86,4.8 27.64,5.38 11,8.79 23.47,10.95
  pour Bottom: 0,30.23 65.02,30.23 65.28,29.97 65.28,0 0,0
  pour Top: 0,0 0,30.23 65.28,30.23 65.28,0
I2C1_SCL  (via drill 0.35)
  Top 0.203: v13.06,4.95 13.03,4.92 Q1.2 | JP1.3 1.93,16.66 8.71,23.44 11.92,23.44 PI1.5
  Top 0.305: Q1.2 13.03,2.32 R2.1
  Bottom 0.203: PI1.5 12.56,24.09 10.52,24.09 10.01,23.57 10.01,6.1 11.15,4.95 v13.06,4.95
I2C1_SDA  (via drill 0.35)
  Top 0.203: v9.65,5.33 9.65,4.09 Q2.2 | PI1.3 10.02,24.09 8.2,24.09 7.73,23.62 7.11,23.62 2.06,18.57 JP1.4
  Top 0.305: Q2.2 9.34,2.45 R4.1
  Bottom 0.203: PI1.3 9.65,23.72 v9.65,5.33
N$1
  Top 0.305: R8.1 15.25,2.13 D1.A
OUT_CS
  Top 0.203: ZX1.1 54.3,20.04 53.31,21.03 51.41,21.03 50.77,20.4 50.77,16.48 48.21,13.92 33.49,13.92 32.73,13.16 24.5,13.16 22.43,11.09 IC3.8 21.68,9.52 R9.2
OUT_MISO
  Top 0.203: IC3.11 24.38,12.45 24.74,12.8 32.87,12.8 33.63,13.56 48.36,13.56 51.77,16.97 ZX1.2
OUT_MOSI
  Top 0.203: IC3.12 25,9.55 25,12.13 25.32,12.45 33.02,12.45 33.78,13.21 45.52,13.21 46.69,12.04 ZX1.13
OUT_SCLK  (via drill 0.35)
  Top 0.203: IC3.10 23.73,8.71 24.27,8.18 27.16,8.18 v27.25,8.27
  Bottom 0.203: v27.25,8.27 46.01,8.27 ZX1.14
PI_CS  (via drill 0.35)
  Top 0.152: IC3.5 23.66,15.45 23.66,18.32 24.46,19.13 28.88,19.13 29.97,20.22 v29.97,23.37
  Bottom 0.152: v29.97,23.37 30.48,23.88 34.37,23.88 35.45,24.96 35.45,25.69 36.56,26.81 PI1.24
PI_MISO
  Top 0.152: IC3.3 25.03,16.4 25.15,16.51 25.48,16.51 27.31,18.34 29.21,18.34 31.45,20.57 31.45,23.69 30.37,24.77 30.37,25.69 31.02,26.35 31.95,26.35 33.06,25.23 PI1.21
PI_MOSI
  Top 0.152: IC3.2 25.68,16.29 27.43,18.03 29.46,18.03 31.75,20.32 31.75,24.96 PI1.19
PI_SCLK
  Top 0.152: IC3.4 24.4,15.39 24.4,16.2 25.02,16.82 25.35,16.82 27.18,18.64 29.08,18.64 31.14,20.7 31.14,23.56 30.06,24.64 30.06,25.82 30.89,26.65 32.07,26.65 32.38,26.35 35.45,26.35 PI1.23
PS_EN
  Top 0.203: PI1.35 50.57,26.46 50.57,28.47 50.01,29.03 18.05,29.03 17.54,28.52 17.54,23.59 17.78,23.35 17.78,21.08 17.39,20.69 PS1.3 16.5,19.03 R5.2
PWR_ADJ
  Top 0.203: PS1.4 19.11,20.11 R6.1 15.63,18.32 15.63,19.65 15.39,19.89 11.89,19.89 10.9,18.9 IC1.6
PWR_EN  (via drill 0.35)
  Top 0.203: v25.2,23.98 25.4,23.77 27.53,23.77 28.72,22.59 R7.1 28.7,22.56 26.89,22.56 Q3.1
  Bottom 0.203: PI1.38 53.08,29.03 25.78,29.03 25.22,28.47 25.22,24 v25.2,23.98
SIG_BUSY  (via drill 0.35)
  Top 0.305: JP2.4 51.05,5.59 50.49,6.15 25.96,6.15 v25.4,5.59 25.4,4.91 R12.1
  Bottom 0.203: v25.4,5.59 25.91,6.1 25.91,22.5 27.03,23.62 28.96,23.62 29.46,24.13 30.09,24.76 30.09,25.7 28.94,26.85 PI1.18
SIG_NG  (via drill 0.35)
  Top 0.305: JP2.6 56.13,5.33 54.41,7.06 24.84,7.06 v23.37,5.59 22.99,5.21 R10.1
  Bottom 0.203: v23.37,5.59 24,6.22 24.51,6.22 25.2,6.91 25.2,22.84 26.4,24.04 PI1.15
SIG_OK  (via drill 0.35)
  Top 0.305: JP2.5 53.59,5.29 52.28,6.6 25.4,6.6 v24.38,5.59 24.51,5.46 R11.1
  Bottom 0.203: v24.38,5.59 25.55,6.76 25.55,22.68 26.91,24.03 27.33,24.03 27.8,24.5 27.8,26.37 PI1.16
SIG_START
  Top 0.203: PI1.40 58.93,25.73 58.93,2.9 57.15,1.12 49.68,1.12 48.51,2.29 JP2.3 | S1.2 28.79,3.35 R13.1
  Top 0.305: JP2.3 48.51,4.93 47.75,5.69 29.23,5.69 27.86,4.32 R13.1

### Text on the board
tNames: GND | WP | MISO | CS | SDA | SCL | +3V3 | GND | MOSI | CLK | HOLD | +V | V OUT | PieFlash v1.0 | GND | +3V3